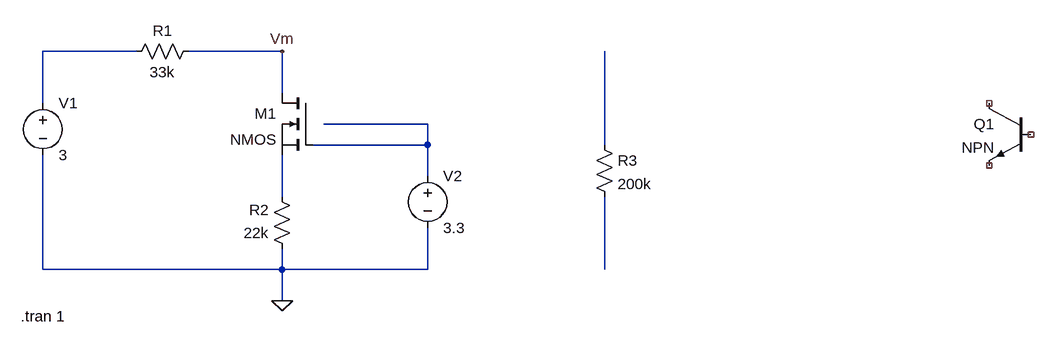
[diagram p0: schematic batt-measure.asc]
batt-measure.asc, the LTspice schematic file:
Version 4
SHEET 1 1224 680
WIRE -160 -320 -304 -320
WIRE 64 -320 -80 -320
WIRE 64 -256 64 -320
WIRE -304 -240 -304 -320
WIRE 288 -208 128 -208
WIRE 288 -176 288 -208
WIRE 288 -176 112 -176
WIRE 560 -176 560 -320
WIRE 288 -128 288 -176
WIRE 64 -96 64 -160
WIRE -304 16 -304 -160
WIRE 64 16 64 -16
WIRE 64 16 -304 16
WIRE 288 16 288 -48
WIRE 288 16 64 16
WIRE 560 16 560 -96
WIRE 64 64 64 16
FLAG 64 64 0
FLAG 64 -320 Vm
SYMBOL nmos 112 -256 M0
SYMATTR InstName M1
SYMBOL res -64 -336 R90
WINDOW 0 0 56 VBottom 2
WINDOW 3 32 56 VTop 2
SYMATTR InstName R1
SYMATTR Value 33k
SYMBOL res 80 0 R180
WINDOW 0 36 76 Left 2
WINDOW 3 36 40 Left 2
SYMATTR InstName R2
SYMATTR Value 22k
SYMBOL voltage -304 -256 R0
WINDOW 123 0 0 Left 0
WINDOW 39 0 0 Left 0
SYMATTR InstName V1
SYMATTR Value 3
SYMBOL voltage 288 -144 R0
WINDOW 123 0 0 Left 0
WINDOW 39 0 0 Left 0
SYMATTR InstName V2
SYMATTR Value 3.3
SYMBOL res 544 -192 R0
SYMATTR InstName R3
SYMATTR Value 200k
SYMBOL npn 1216 -240 M0
SYMATTR InstName Q1
TEXT -338 88 Left 2 !.tran 1

The netlist it stands for:
* batt-measure.asc
M1 Vm N002 N004 N004 NMOS
R1 Vm N001 33k
R2 0 N004 22k
V1 N001 0 3
V2 N002 0 3.3
R3 N003 N005 200k
Q1 NC_01 NC_02 NC_03 0 NPN
.model NPN NPN
.model PNP PNP
.lib standard.bjt
.model NMOS NMOS
.model PMOS PMOS
.lib standard.mos
.tran 1
.backanno
.end